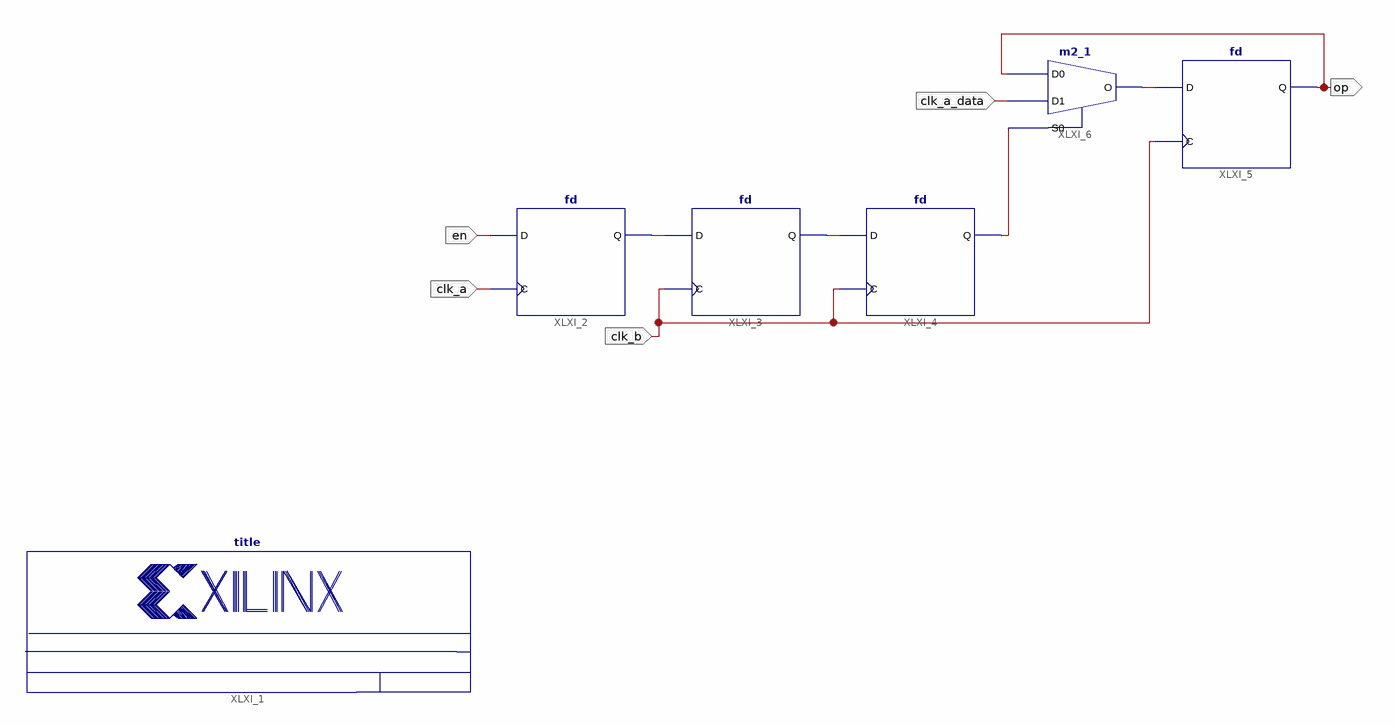
[diagram p0: schematic sheet 1]
// Xilinx ISE schematic MUX_SYNCHRONIZER.sch (spartan3e) as structural Verilog: 6 symbols, 5 ports
module MUX_SYNCHRONIZER (
  input  clk_b,
  input  en,
  input  clk_a,
  input  clk_a_data,
  output op
);

  wire XLXN_1, XLXN_4, XLXN_5, XLXN_9;

  title #(.NameFieldText("Karthik Vippala")) XLXI_1 ();
  fd XLXI_2 (.C(clk_a), .D(en), .Q(XLXN_9));
  fd XLXI_3 (.C(clk_b), .D(XLXN_9), .Q(XLXN_4));
  fd XLXI_4 (.C(clk_b), .D(XLXN_4), .Q(XLXN_5));
  fd #(.INIT("0")) XLXI_5 (.C(clk_b), .D(XLXN_1), .Q(op));
  m2_1 XLXI_6 (.D0(op), .D1(clk_a_data), .S0(XLXN_5), .O(XLXN_1));
endmodule
